# Altium schematic sheet V-by-One.SchDoc
size 420 x 297 mm; SheetNumber: 21; SheetTotal: 32; DocumentTypeShort: Э3; DocumentInvertoryNumber: ㅤ
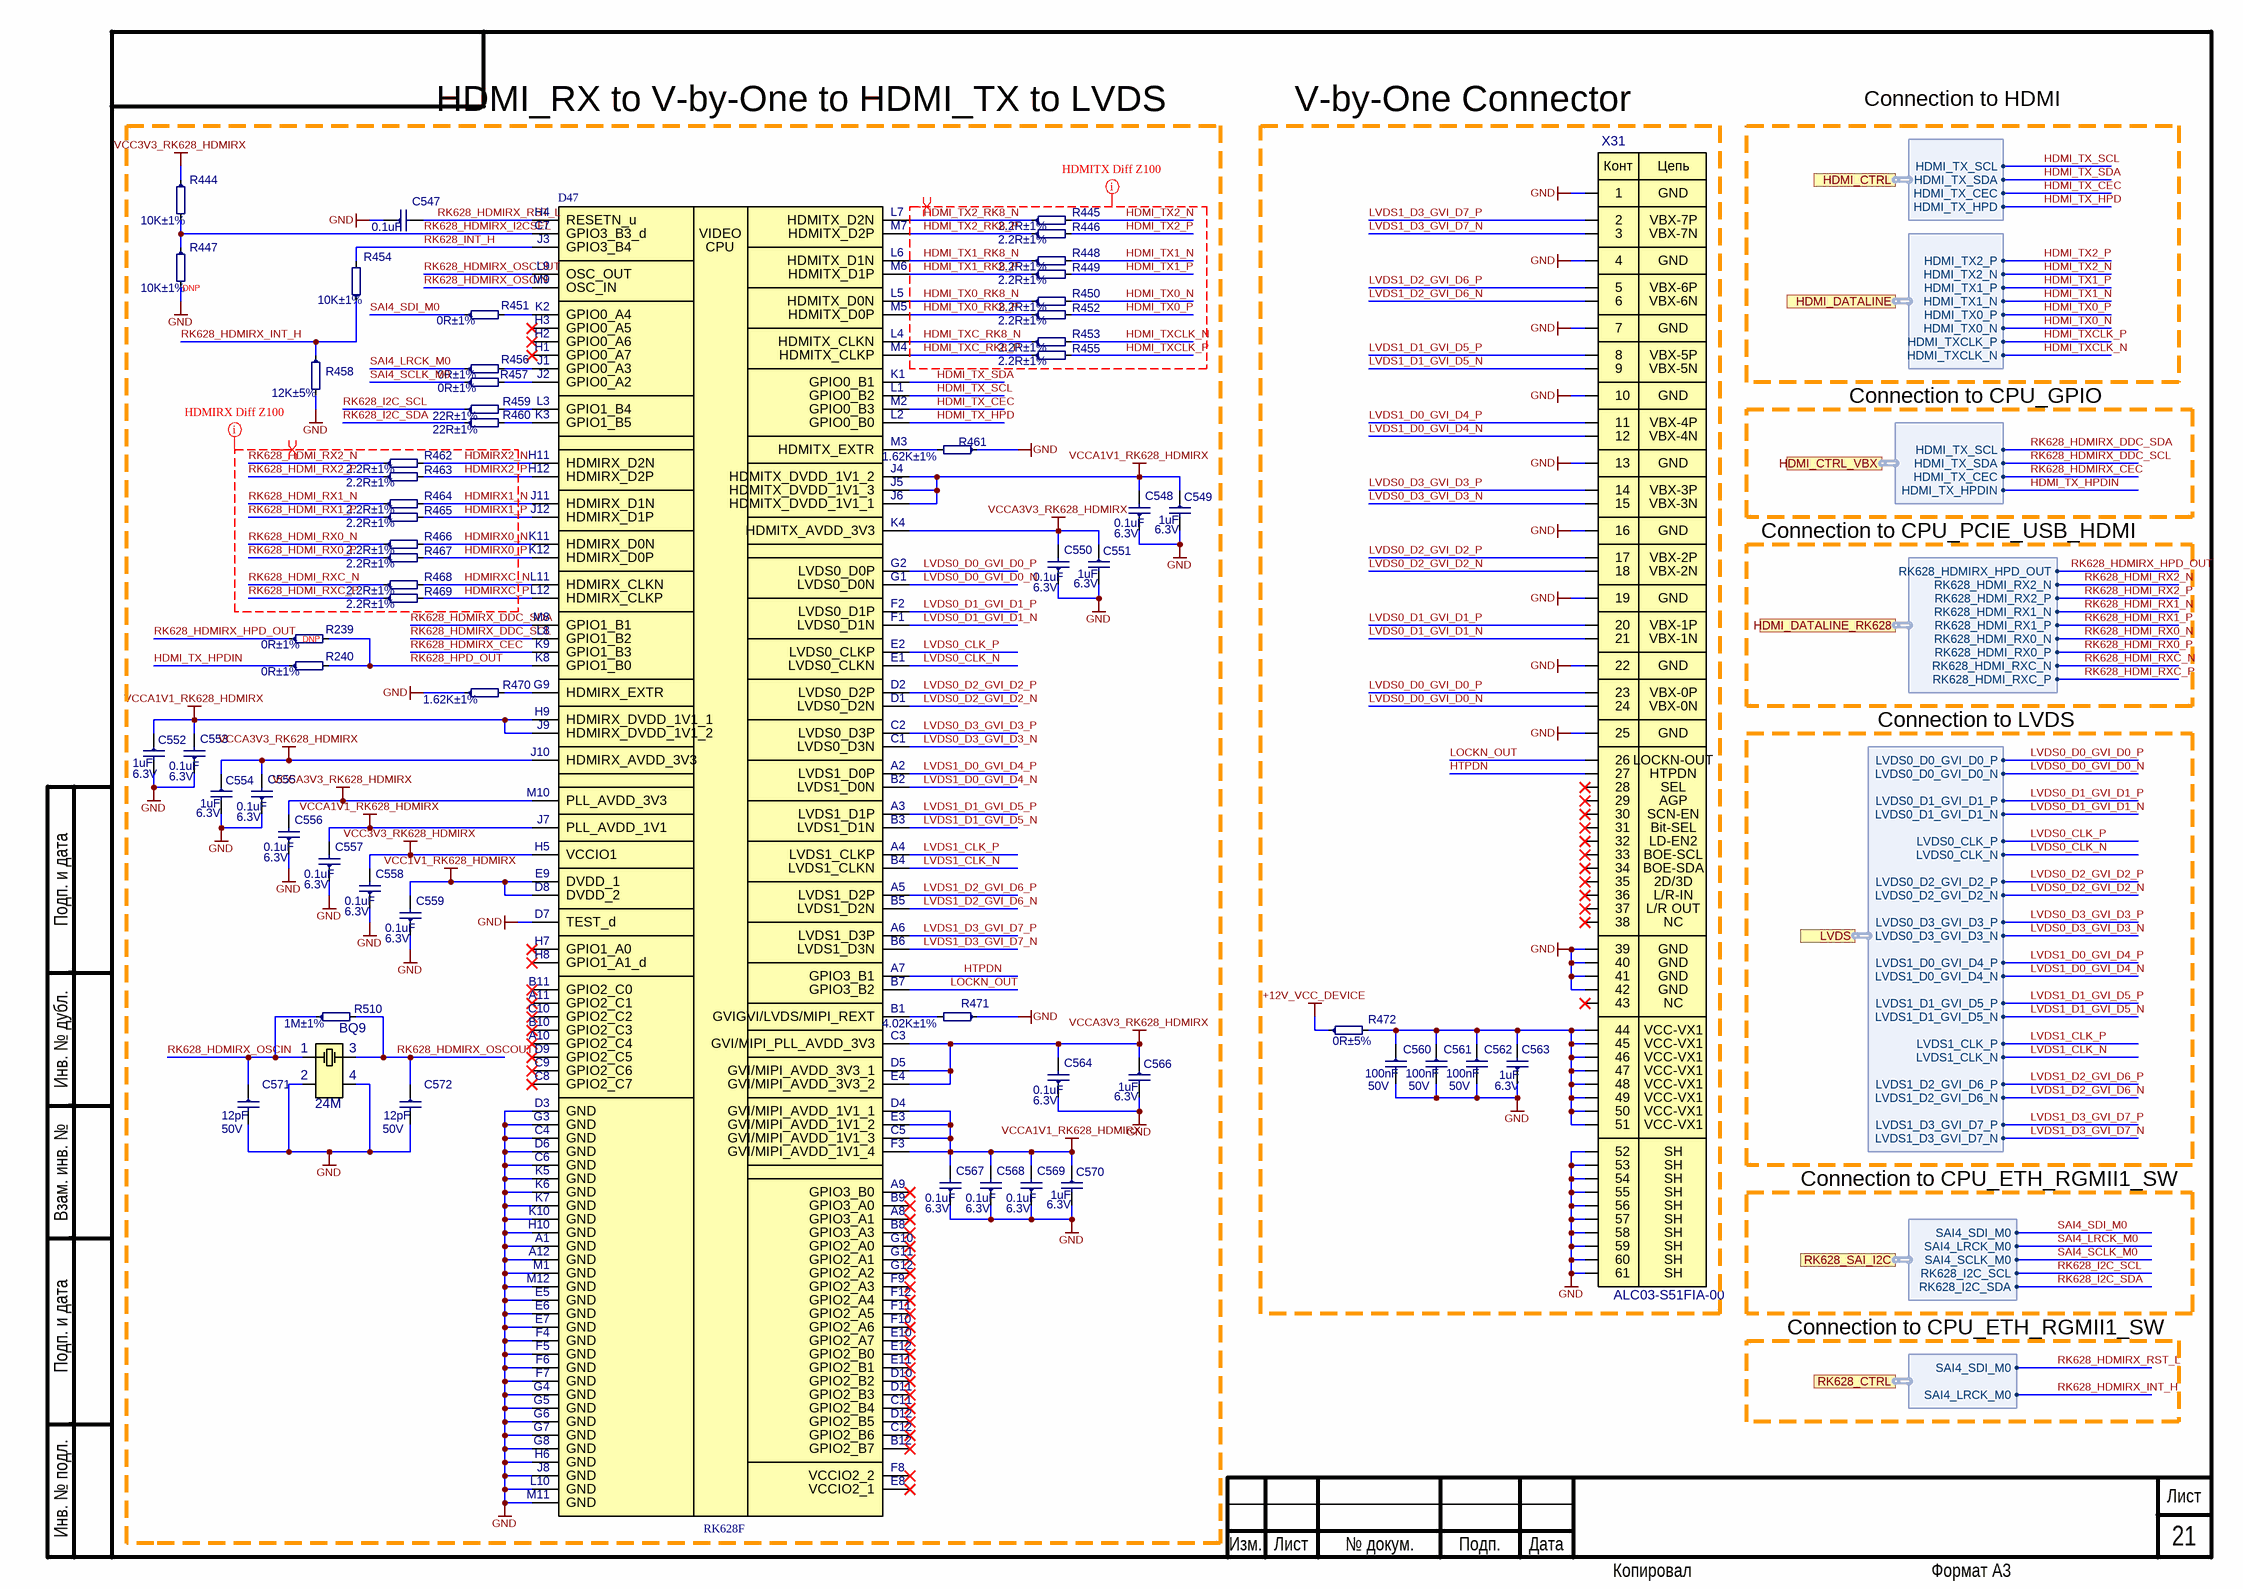
[diagram p0: V-by-One.SchDoc]

## Parts
BQ9  24M  [NX3225GA]
C547  0.1uF  [C0201]
C548  0.1uF  Voltage: 6.3V  [C0201]
C549  1uF  Voltage: 6.3V  [C0201]
C550  0.1uF  Voltage: 6.3V  [C0201]
C551  1uF  Voltage: 6.3V  [C0201]
C552  1uF  Voltage: 6.3V  [C0201]
C553  0.1uF  Voltage: 6.3V  [C0201]
C554  1uF  Voltage: 6.3V  [C0201]
C555  0.1uF  Voltage: 6.3V  [C0201]
C556  0.1uF  Voltage: 6.3V  [C0201]
C557  0.1uF  Voltage: 6.3V  [C0201]
C558  0.1uF  Voltage: 6.3V  [C0201]
C559  0.1uF  Voltage: 6.3V  [C0201]
C560  100nF  Voltage: 50V  [C0402]
C561  100nF  Voltage: 50V  [C0402]
C562  100nF  Voltage: 50V  [C0402]
C563  1uF  Voltage: 6.3V  [C0201]
C564  0.1uF  Voltage: 6.3V  [C0201]
C566  1uF  Voltage: 6.3V  [C0201]
C567  0.1uF  Voltage: 6.3V  [C0201]
C568  0.1uF  Voltage: 6.3V  [C0201]
C569  0.1uF  Voltage: 6.3V  [C0201]
C570  1uF  Voltage: 6.3V  [C0201]
C571  12pF  Voltage: 50V  [C0402]
C572  12pF  Voltage: 50V  [C0402]
D47  RK628F  [RK628F]
R239  0R±1%  [R0402]
R240  0R±1%  [R0402]
R444  10K±1%  [R0402]
R445  2.2R±1%  [R0402]
R446  2.2R±1%  [R0402]
R447  10K±1%  [R0402]
R448  2.2R±1%  [R0402]
R449  2.2R±1%  [R0402]
R450  2.2R±1%  [R0402]
R451  0R±1%  [R0402]
R452  2.2R±1%  [R0402]
R453  2.2R±1%  [R0402]
R454  10K±1%  [R0402]
R455  2.2R±1%  [R0402]
R456  0R±1%  [R0402]
R457  0R±1%  [R0402]
R458  12K±5%  [R0402]
R459  22R±1%  [R0402]
R460  22R±1%  [R0402]
R461  1.62K±1%  [R0402]
R462  2.2R±1%  [R0402]
R463  2.2R±1%  [R0402]
R464  2.2R±1%  [R0402]
R465  2.2R±1%  [R0402]
R466  2.2R±1%  [R0402]
R467  2.2R±1%  [R0402]
R468  2.2R±1%  [R0402]
R469  2.2R±1%  [R0402]
R470  1.62K±1%  [R0402]
R471  4.02K±1%  [R0402]
R472  0R±5%  [R2010]
R510  1M±1%  [R0402]
X31  ALC03-S51FIA-00  [ALC03-S51FIA-00]

## Ports
HDMI_CTRL (harness HDMI_CTRL), HDMI_CTRL_VBX (harness HDMI_CTRL_VBX), HDMI_DATALINE (harness HDMI_DATALINE), HDMI_DATALINE_RK628 (harness HDMI_DATALINE_RK628), LVDS (harness LVDS), RK628_CTRL (harness RK628_CTRL), RK628_SAI_I2C (harness RK628_SAI_I2C)

## Harnesses
HDMI_CTRL: HDMI_TX_SDA, HDMI_TX_CEC, HDMI_TX_HPD, HDMI_TX_SCL
HDMI_DATALINE: HDMI_TX2_N, HDMI_TX1_P, HDMI_TX1_N, HDMI_TX2_P, HDMI_TX0_P, HDMI_TX0_N, HDMI_TXCLK_P, HDMI_TXCLK_N
HDMI_CTRL_VBX: HDMI_TX_SDA, HDMI_TX_CEC, HDMI_TX_SCL, HDMI_TX_HPDIN
LVDS: LVDS0_D0_GVI_D0_N, LVDS0_D1_GVI_D1_P, LVDS0_D1_GVI_D1_N, LVDS0_D0_GVI_D0_P, LVDS0_CLK_P, LVDS0_CLK_N, LVDS0_D2_GVI_D2_P, LVDS0_D2_GVI_D2_N, LVDS0_D3_GVI_D3_P, LVDS0_D3_GVI_D3_N, LVDS1_D0_GVI_D4_P, LVDS1_D0_GVI_D4_N, LVDS1_D1_GVI_D5_P, LVDS1_D1_GVI_D5_N, LVDS1_CLK_P, LVDS1_CLK_N, LVDS1_D2_GVI_D6_P, LVDS1_D2_GVI_D6_N, LVDS1_D3_GVI_D7_P, LVDS1_D3_GVI_D7_N
HDMI_DATALINE_RK628: RK628_HDMI_RX2_P, RK628_HDMI_RX1_N, RK628_HDMI_RX1_P, RK628_HDMI_RX2_N, RK628_HDMI_RX0_N, RK628_HDMI_RX0_P, RK628_HDMI_RXC_N, RK628_HDMI_RXC_P, RK628_HDMIRX_HPD_OUT
RK628_SAI_I2C: SAI4_LRCK_M0, SAI4_SCLK_M0, SAI4_SDI_M0, RK628_I2C_SCL, RK628_I2C_SDA
RK628_CTRL: SAI4_LRCK_M0, SAI4_SDI_M0

## Nets
+12V_VCC_DEVICE: R472.1
GND: BQ9.2 BQ9.4 C547.1 C548.1 C549.2 C550.1 C551.2 C552.2 C553.1 C554.2 C555.1 C556.1 C557.1 C558.1 C559.1 C560.2 C561.2 C562.2 C563.1 C564.1 C566.2 C567.1 C568.1 C569.1 C570.2 C571.2 C572.2 D47.A1(GND) D47.A12(GND) D47.C4(GND) D47.C6(GND) D47.D3(GND) D47.D6(GND) D47.D7(TEST_d) D47.E5(GND) D47.E6(GND) D47.E7(GND) D47.F4(GND) D47.F5(GND) D47.F6(GND) D47.F7(GND) D47.G3(GND) D47.G4(GND) D47.G5(GND) D47.G6(GND) D47.G7(GND) D47.G8(GND) D47.H6(GND) D47.H10(GND) D47.J8(GND) D47.K5(GND) D47.K6(GND) D47.K7(GND) D47.K10(GND) D47.L10(GND) D47.M1(GND) D47.M11(GND) D47.M12(GND) R447.2 R458.2 R461.1 R470.1 R471.1 X31.1 X31.4 X31.7 X31.10 X31.13 X31.16 X31.19 X31.22 X31.25 X31.39 X31.40 X31.41 X31.42 X31.52 X31.53 X31.54 X31.55 X31.56 X31.57 X31.58 X31.59 X31.60 X31.61
VCC1V1_RK628_HDMIRX: C559.2 D47.D8(DVDD_2) D47.E9(DVDD_1)
VCC3V3_RK628_HDMIRX: C558.2 D47.H5(VCCIO1) R444.1
VCCA1V1_RK628_HDMIRX: C548.2 C549.1 C552.1 C553.2 C557.2 C567.2 C568.2 C569.2 C570.1 D47.C5(GVI/MIPI_AVDD_1V1_3) D47.D4(GVI/MIPI_AVDD_1V1_1) D47.E3(GVI/MIPI_AVDD_1V1_2) D47.F3(GVI/MIPI_AVDD_1V1_4) D47.H9(HDMIRX_DVDD_1V1_1) D47.J4(HDMITX_DVDD_1V1_2) D47.J5(HDMITX_DVDD_1V1_3) D47.J6(HDMITX_DVDD_1V1_1) D47.J7(PLL_AVDD_1V1) D47.J9(HDMIRX_DVDD_1V1_2)
VCCA3V3_RK628_HDMIRX: C550.2 C551.1 C554.1 C555.2 C556.2 C564.2 C566.1 D47.C3(GVI/MIPI_PLL_AVDD_3V3) D47.D5(GVI/MIPI_AVDD_3V3_1) D47.E4(GVI/MIPI_AVDD_3V3_2) D47.J10(HDMIRX_AVDD_3V3) D47.K4(HDMITX_AVDD_3V3) D47.M10(PLL_AVDD_3V3)
HDMI_TX0_N: R450.2 ; port HDMI_DATALINE.HDMI_TX0_N
HDMI_TX0_P: R452.2 ; port HDMI_DATALINE.HDMI_TX0_P
HDMI_TX0_RK8_N: D47.L5(HDMITX_D0N) R450.1
HDMI_TX0_RK8_P: D47.M5(HDMITX_D0P) R452.1
HDMI_TX1_N: R448.2 ; port HDMI_DATALINE.HDMI_TX1_N
HDMI_TX1_P: R449.2 ; port HDMI_DATALINE.HDMI_TX1_P
HDMI_TX1_RK8_N: D47.L6(HDMITX_D1N) R448.1
HDMI_TX1_RK8_P: D47.M6(HDMITX_D1P) R449.1
HDMI_TX2_N: R445.2 ; port HDMI_DATALINE.HDMI_TX2_N
HDMI_TX2_P: R446.2 ; port HDMI_DATALINE.HDMI_TX2_P
HDMI_TX2_RK8_N: D47.L7(HDMITX_D2N) R445.1
HDMI_TX2_RK8_P: D47.M7(HDMITX_D2P) R446.1
HDMI_TX_CEC: D47.M2(GPIO0_B3) ; port HDMI_CTRL.HDMI_TX_CEC
HDMI_TX_HPD: D47.L2(GPIO0_B0) ; port HDMI_CTRL.HDMI_TX_HPD
HDMI_TX_HPDIN: R240.1 ; port HDMI_CTRL_VBX.HDMI_TX_HPDIN
HDMI_TX_SCL: D47.L1(GPIO0_B2) ; port HDMI_CTRL.HDMI_TX_SCL
HDMI_TX_SDA: D47.K1(GPIO0_B1) ; port HDMI_CTRL.HDMI_TX_SDA
HDMI_TXC_RK8_N: D47.L4(HDMITX_CLKN) R453.1
HDMI_TXC_RK8_P: D47.M4(HDMITX_CLKP) R455.1
HDMI_TXCLK_N: R453.2 ; port HDMI_DATALINE.HDMI_TXCLK_N
HDMI_TXCLK_P: R455.2 ; port HDMI_DATALINE.HDMI_TXCLK_P
HDMIRX0_N: D47.K11(HDMIRX_D0N) R466.2
HDMIRX0_P: D47.K12(HDMIRX_D0P) R467.2
HDMIRX1_N: D47.J11(HDMIRX_D1N) R464.2
HDMIRX1_P: D47.J12(HDMIRX_D1P) R465.2
HDMIRX2_N: D47.H11(HDMIRX_D2N) R462.2
HDMIRX2_P: D47.H12(HDMIRX_D2P) R463.2
HDMIRXC_N: D47.L11(HDMIRX_CLKN) R468.2
HDMIRXC_P: D47.L12(HDMIRX_CLKP) R469.2
HTPDN: D47.A7(GPIO3_B1) X31.27
LOCKN_OUT: D47.B7(GPIO3_B2) X31.26
LVDS0_CLK_N: D47.E1(LVDS0_CLKN) ; port LVDS.LVDS0_CLK_N
LVDS0_CLK_P: D47.E2(LVDS0_CLKP) ; port LVDS.LVDS0_CLK_P
LVDS0_D0_GVI_D0_N: D47.G1(LVDS0_D0N) X31.24 ; port LVDS.LVDS0_D0_GVI_D0_N
LVDS0_D0_GVI_D0_P: D47.G2(LVDS0_D0P) X31.23 ; port LVDS.LVDS0_D0_GVI_D0_P
LVDS0_D1_GVI_D1_N: D47.F1(LVDS0_D1N) X31.21 ; port LVDS.LVDS0_D1_GVI_D1_N
LVDS0_D1_GVI_D1_P: D47.F2(LVDS0_D1P) X31.20 ; port LVDS.LVDS0_D1_GVI_D1_P
LVDS0_D2_GVI_D2_N: D47.D1(LVDS0_D2N) X31.18 ; port LVDS.LVDS0_D2_GVI_D2_N
LVDS0_D2_GVI_D2_P: D47.D2(LVDS0_D2P) X31.17 ; port LVDS.LVDS0_D2_GVI_D2_P
LVDS0_D3_GVI_D3_N: D47.C1(LVDS0_D3N) X31.15 ; port LVDS.LVDS0_D3_GVI_D3_N
LVDS0_D3_GVI_D3_P: D47.C2(LVDS0_D3P) X31.14 ; port LVDS.LVDS0_D3_GVI_D3_P
LVDS1_CLK_N: D47.B4(LVDS1_CLKN) ; port LVDS.LVDS1_CLK_N
LVDS1_CLK_P: D47.A4(LVDS1_CLKP) ; port LVDS.LVDS1_CLK_P
LVDS1_D0_GVI_D4_N: D47.B2(LVDS1_D0N) X31.12 ; port LVDS.LVDS1_D0_GVI_D4_N
LVDS1_D0_GVI_D4_P: D47.A2(LVDS1_D0P) X31.11 ; port LVDS.LVDS1_D0_GVI_D4_P
LVDS1_D1_GVI_D5_N: D47.B3(LVDS1_D1N) X31.9 ; port LVDS.LVDS1_D1_GVI_D5_N
LVDS1_D1_GVI_D5_P: D47.A3(LVDS1_D1P) X31.8 ; port LVDS.LVDS1_D1_GVI_D5_P
LVDS1_D2_GVI_D6_N: D47.B5(LVDS1_D2N) X31.6 ; port LVDS.LVDS1_D2_GVI_D6_N
LVDS1_D2_GVI_D6_P: D47.A5(LVDS1_D2P) X31.5 ; port LVDS.LVDS1_D2_GVI_D6_P
LVDS1_D3_GVI_D7_N: D47.B6(LVDS1_D3N) X31.3 ; port LVDS.LVDS1_D3_GVI_D7_N
LVDS1_D3_GVI_D7_P: D47.A6(LVDS1_D3P) X31.2 ; port LVDS.LVDS1_D3_GVI_D7_P
RK628_HDMI_RX0_N: R466.1 ; port HDMI_DATALINE_RK628.RK628_HDMI_RX0_N
RK628_HDMI_RX0_P: R467.1 ; port HDMI_DATALINE_RK628.RK628_HDMI_RX0_P
RK628_HDMI_RX1_N: R464.1 ; port HDMI_DATALINE_RK628.RK628_HDMI_RX1_N
RK628_HDMI_RX1_P: R465.1 ; port HDMI_DATALINE_RK628.RK628_HDMI_RX1_P
RK628_HDMI_RX2_N: R462.1 ; port HDMI_DATALINE_RK628.RK628_HDMI_RX2_N
RK628_HDMI_RX2_P: R463.1 ; port HDMI_DATALINE_RK628.RK628_HDMI_RX2_P
RK628_HDMI_RXC_N: R468.1 ; port HDMI_DATALINE_RK628.RK628_HDMI_RXC_N
RK628_HDMI_RXC_P: R469.1 ; port HDMI_DATALINE_RK628.RK628_HDMI_RXC_P
RK628_HDMIRX_CEC: D47.K9(GPIO1_B3) ; port HDMI_CTRL_VBX.HDMI_TX_CEC
RK628_HDMIRX_DDC_SCL: D47.L8(GPIO1_B2) ; port HDMI_CTRL_VBX.HDMI_TX_SDA
RK628_HDMIRX_DDC_SDA: D47.M8(GPIO1_B1) ; port HDMI_CTRL_VBX.HDMI_TX_SCL
RK628_HDMIRX_HPD_OUT: R239.1 ; port HDMI_DATALINE_RK628.RK628_HDMIRX_HPD_OUT
RK628_HDMIRX_I2CSEL: D47.C7(GPIO3_B3_d) R444.2 R447.1
RK628_HDMIRX_INT_H: R454.1 R458.1 ; port RK628_CTRL.SAI4_LRCK_M0
RK628_HDMIRX_OSCIN: BQ9.1 C571.1 D47.M9(OSC_IN) R510.1
RK628_HDMIRX_OSCOUT: BQ9.3 C572.1 D47.L9(OSC_OUT) R510.2
RK628_HDMIRX_RST_L: C547.2 D47.H4(RESETN_u) ; port RK628_CTRL.SAI4_SDI_M0
RK628_HPD_OUT: D47.K8(GPIO1_B0) R239.2 R240.2
RK628_I2C_SCL: R459.1 ; port RK628_SAI_I2C.RK628_I2C_SCL
RK628_I2C_SDA: R460.1 ; port RK628_SAI_I2C.RK628_I2C_SDA
RK628_INT_H: D47.J3(GPIO3_B4) R454.2
SAI4_LRCK_M0: R456.1 ; port RK628_SAI_I2C.SAI4_LRCK_M0
SAI4_SCLK_M0: R457.1 ; port RK628_SAI_I2C.SAI4_SCLK_M0
SAI4_SDI_M0: R451.1 ; port RK628_SAI_I2C.SAI4_SDI_M0
NetC560_1: C560.1 C561.1 C562.1 C563.2 R472.2 X31.44 X31.45 X31.46 X31.47 X31.48 X31.49 X31.50 X31.51
NetD47_B1: D47.B1(GVIGVI/LVDS/MIPI_REXT) R471.2
NetD47_G9: D47.G9(HDMIRX_EXTR) R470.2
NetD47_J1: D47.J1(GPIO0_A3) R456.2
NetD47_J2: D47.J2(GPIO0_A2) R457.2
NetD47_K2: D47.K2(GPIO0_A4) R451.2
NetD47_K3: D47.K3(GPIO1_B5) R460.2
NetD47_L3: D47.L3(GPIO1_B4) R459.2
NetD47_M3: D47.M3(HDMITX_EXTR) R461.2

Not connected (* = marked no-connect by the designer): D47 A8(GPIO3_A1)* A9(GPIO3_B0)* A10(GPIO2_C4)* A11(GPIO2_C1)* B8(GPIO3_A3)* B9(GPIO3_A0)* B10(GPIO2_C3)* B11(GPIO2_C0)* B12(GPIO2_B7)* C8(GPIO2_C7)* C9(GPIO2_C6)* C10(GPIO2_C2)* C11(GPIO2_B4)* C12(GPIO2_B6)* D9(GPIO2_C5)* D10(GPIO2_B2)* D11(GPIO2_B3)* D12(GPIO2_B5)* E8(VCCIO2_1)* E10(GPIO2_A7)* E11(GPIO2_B1)* E12(GPIO2_B0)* F8(VCCIO2_2)* F9(GPIO2_A3)* F10(GPIO2_A6)* F11(GPIO2_A5)* F12(GPIO2_A4)* G10(GPIO2_A0)* G11(GPIO2_A1)* G12(GPIO2_A2)* H1(GPIO0_A7)* H2(GPIO0_A6)* H3(GPIO0_A5)* H7(GPIO1_A0)* H8(GPIO1_A1_d)*; X31 28* 29* 30* 31* 32* 33* 34* 35* 36* 37* 38* 43*

## Layout directives
net class HDMIRX: HDMIRX0_N, HDMIRX0_P, HDMIRX1_N, HDMIRX1_P, HDMIRX2_N, HDMIRX2_P, HDMIRXC_N, HDMIRXC_P, RK628_HDMI_RX0_N, RK628_HDMI_RX0_P, RK628_HDMI_RX1_N, RK628_HDMI_RX1_P, RK628_HDMI_RX2_N, RK628_HDMI_RX2_P, RK628_HDMI_RXC_N, RK628_HDMI_RXC_P
net class HDMITX: HDMI_TX0_N, HDMI_TX0_P, HDMI_TX0_RK8_N, HDMI_TX0_RK8_P, HDMI_TX1_N, HDMI_TX1_P, HDMI_TX1_RK8_N, HDMI_TX1_RK8_P, HDMI_TX2_N, HDMI_TX2_P, HDMI_TX2_RK8_N, HDMI_TX2_RK8_P, HDMI_TXC_RK8_N, HDMI_TXC_RK8_P, HDMI_TXCLK_N, HDMI_TXCLK_P
differential pair; differential pair class Diff_Z100: HDMI_TX0_N, HDMI_TX0_P, HDMI_TX0_RK8_N, HDMI_TX0_RK8_P, HDMI_TX1_N, HDMI_TX1_P, HDMI_TX1_RK8_N, HDMI_TX1_RK8_P, HDMI_TX2_N, HDMI_TX2_P, HDMI_TX2_RK8_N, HDMI_TX2_RK8_P, HDMI_TXC_RK8_N, HDMI_TXC_RK8_P, HDMI_TXCLK_N, HDMI_TXCLK_P, HDMIRX0_N, HDMIRX0_P, HDMIRX1_N, HDMIRX1_P, HDMIRX2_N, HDMIRX2_P, HDMIRXC_N, HDMIRXC_P, RK628_HDMI_RX0_N, RK628_HDMI_RX0_P, RK628_HDMI_RX1_N, RK628_HDMI_RX1_P, RK628_HDMI_RX2_N, RK628_HDMI_RX2_P, RK628_HDMI_RXC_N, RK628_HDMI_RXC_P

## Notes on the sheet
- HDMI_RX to V-by-One to HDMI_TX to LVDS
- V-by-One Connector
- Connection to HDMI
- (near R447) DNP
- Connection to CPU_GPIO
- Connection to CPU_PCIE_USB_HDMI
- (near R239) DNP
- Connection to LVDS
- Connection to CPU_ETH_RGMII1_SW
- Подп. и дата
- Инв. № дубл.
- Взам. инв. №
- Инв. № подл.
- Изм.
- Лист
- № докум.
- Подп.
- Дата
- Копировал
- Формат А3
- (in symbol ALC03-S51FIA-00) Конт; Цепь; GND; VBX-7P; VBX-7N; VBX-6P; VBX-6N; VBX-5P; VBX-5N; VBX-4P; VBX-4N; VBX-3P; VBX-3N; VBX-2P; VBX-2N; VBX-1P; VBX-1N; VBX-0P; VBX-0N; LOCKN-OUT; HTPDN; SEL; AGP; SCN-EN; Bit-SEL; LD-EN2; BOE-SCL; BOE-SDA; 2D/3D; L/R-IN; L/R OUT; NC; VCC-VX1; SH
- (in symbol RK628F) VIDEO; CPU

## Library data of the parts
BQ9 = NX3225GA-24M-18pF-10ppm: Part Number: 3225-24-18-10-10/4B; Manufacturer: Liming; Place: S; Tolerance: 10ppm; Check: False; Value: 24M; NameFromManufacturer: 3225-24-18-10-10/4B; ComponentLink1Description: DATASHEET; ComponentLink1URL: https://www.raltron.com/wp-content/uploads/2019/07/RH100_SERIES-July-2019.pdf; Last changed: 27.10.2022
C547 = 0201-X5R-6.3V-0.1uF±10%: Manufacturer: Yageo; NameFromManufacturer: CC0201KRX5R5BB104; Dielectric: X5R; Voltage: 6.3V; Place: *); Tolerance: 10%; Check: False; Case: C0201; Part Number: 0201-X5R-6.3V-0.1uF±10%; Value: 0.1uF; Temperature: -55°C~85°C; ComponentLink2Description: Link to datasheet; ComponentLink1Description: DATASHEET; ComponentLink2URL: https://www.terraelectronica.ru/product/1020032; ComponentLink1URL: Datasheets/capacitors/UPY-GPHC_X5R_4V-to-50V_27.pdf; Last changed: 27.10.2022
C548 C550 C553 C555-C559 C564 C567-C569 = 0201-X5R-6.3V-0.1uF±10%: Manufacturer: Yageo; NameFromManufacturer: CC0201KRX5R5BB104; Dielectric: X5R; Place: *); Tolerance: 10%; Check: False; Case: C0201; Part Number: 0201-X5R-6.3V-0.1uF±10%; Value: 0.1uF; Temperature: -55°C~85°C; ComponentLink2Description: Link to datasheet; ComponentLink1Description: DATASHEET; ComponentLink2URL: https://www.terraelectronica.ru/product/1020032; ComponentLink1URL: Datasheets/capacitors/UPY-GPHC_X5R_4V-to-50V_27.pdf; Last changed: 27.10.2022
C549 C551 C552 C554 C563 C566 C570 = 0201-X5R-6.3V-1uF±20%: Manufacturer: Murata Electronics; NameFromManufacturer: GRM033R60J105MEA2D; Dielectric: X5R; Place: *); Tolerance: 20%; Check: False; Case: C0201; Part Number: 0201-X5R-6.3V-1uF±20%; Value: 1uF; Temperature: -55°C~85°C; ComponentLink2Description: Link to datasheet; ComponentLink1Description: DATASHEET; ComponentLink2URL: https://www.terraelectronica.ru/product/1209278; ComponentLink1URL: Datasheets/capacitors/GRM033R60J105MEA2-61A.pdf; Last changed: 27.10.2022
C560-C562 = 0402-X7R-50V-0.1uF±10%: Ceramic Capacitor 0402 100nF ±10% 50V X7R; Manufacturer: Yageo; NameFromManufacturer: CC0402KRX7R9BB104; Place: *); Check: False; Dielectric: X7R; Case: C0402; Part Number: 0402-X7R-50V-0.1uF±10%; Value: 100nF; Tolerance: 10%; Temperature: -55°C~125°C; ComponentLink2Description: Link to datasheet; ComponentLink1Description: DATASHEET; ComponentLink2URL: https://www.lcsc.com/product-detail/Multilayer-Ceramic-Capacitors-MLCC-SMD-SMT_YAGEO-CC0402KRX7R9BB104_C131394.html; Last changed: 09.04.2025
C571 C572 = 0402-NP0-50V-12pF±5%: Manufacturer: Murata Electronics; NameFromManufacturer: GRM1555C1H120JA01D; Dielectric: NP0; Place: *); Tolerance: 5%; Check: False; Case: C0402; Part Number: 0402-NP0-50V-12pF±5%; Value: 12pF; Temperature: -55°C~125°C; ComponentLink2Description: Link to datasheet; ComponentLink1Description: DATASHEET; ComponentLink2URL: https://www.terraelectronica.ru/pdf/show?pdf_file=http%253A%252F%252Fwww.farnell.com%252Fdatasheets%252F2048662.pdf; ComponentLink1URL: Datasheets/capacitors/GRM1555C1H120JA01-01A.pdf; Last changed: 27.10.2022
D47 = RK628F: Bridge BGA-144L(8x8) Video Processing RoHS; Manufacturer: Rockchip; Check: False; Part Number: RK628F; Value: RK628F; NameFromManufacturer: RK628F
R239 R240 R451 R456 R457 = 0402-0.0625W-0R-100ppm±1%: Chip Resistor 0402 0Ω ±1% 50V ±100ppm/℃ Thick Film; NameFromManufacturer: RC0402FR-070RL; Manufacturer: Yageo; Place: *); Value: 0R; Check: False; Case: R0402; Part Number: 0402-0.0625W-0R-100ppm±1%; Tolerance: 1%; Temperature: -55°C~155°C; ComponentLink1Description: DATASHEET; ComponentLink1URL: https://www.chipdip.ru/product0/8000617426?ysclid=l7og5x0plo427794326; Datasheet: Datasheets/resistors/DOC012445956.pdf; Last changed: 27.10.2022
R444 R447 R454 = 0402-0.0625W-10K-100ppm±1%: Chip Resistor 0402 10kΩ ±1% 50V ±100ppm/℃ Thick Film; NameFromManufacturer: RC0402FR-0710KL; Manufacturer: Yageo; Place: *); Value: 10K; Check: False; Case: R0402; Part Number: 0402-0.0625W-10K-100ppm±1%; Tolerance: 1%; Temperature: -55°C~155°C; ComponentLink1Description: DATASHEET; ComponentLink1URL: https://ru.mouser.com/ProductDetail/YAGEO/RC0402FR-0710KL?qs=%2Fha2pyFaduhjtLcYvKXQ8IogF7YwN7YtH%252BOO8ZtEEMnoa4yoWYcwpw%3D%3D; Datasheet: Datasheets/resistors/PYu-RC_Group_51_RoHS_L_11.pdf; Last changed: 27.10.2022
R445 R446 R448-R450 R452 R453 R455 R462-R469 = 0402-0.0625W-1.2R-100ppm±1%: Part Number: 0402-0.0625W-2.2R-100ppm±1%; NameFromManufacturer: AC0402FR-072R2L; Manufacturer: Yageo; Place: *); Value: 2.2R; Tolerance: 1%; Check: False; Case: R0402; Temperature: -55°C~155°C; ComponentLink1Description: DATASHEET; ComponentLink1URL: https://www.chipdip.ru/product0/9000189669; Datasheet: Datasheets/resistors/DOC011312614.pdf; Last changed: 27.10.2022
R458 = 0402-0.0625W-12K-100ppm±5%: NameFromManufacturer: WR04X123JTL; Manufacturer: Walsin Technology Corporation; Place: *); Value: 12K; Tolerance: 5%; Check: False; Case: R0402; Part Number: 0402-0.0625W-12K-100ppm±5%; Temperature: -55°C~155°C; ComponentLink1Description: DATASHEET; ComponentLink1URL: https://eu.mouser.com/ProductDetail/Walsin/WR04X123-JTL?qs=1w%252B2sDiFrrEqkjp89ZDzsQ%3D%3D; Datasheet: Datasheets\resistors\WR04X103JTL-datasheet-pdf-ru.findic.com.pdf#Datasheets\resistors\WR04X103JTL-datasheet-pdf-ru.findic.com.pdf#; Last changed: 07.11.2022
R459 R460 = 0402-0.0625W-22R-100ppm±1%: Chip Resistor 0402 22Ω ±1% 50V ±100ppm/℃ Thick Film; NameFromManufacturer: RC0402FR-0722RL; Manufacturer: Yageo; Place: *); Value: 22R; Check: False; Case: R0402; Part Number: 0402-0.0625W-22R-100ppm±1%; Tolerance: 1%; Temperature: -55°C~155°C; ComponentLink1Description: DATASHEET; ComponentLink1URL: https://www.yageo.com/upload/media/product/productsearch/datasheet/rchip/PYu-RC_Group_51_RoHS_L_11.pdf; Datasheet: Datasheets/resistors/PYu-RC_Group_51_RoHS_L_11.pdf; Last changed: 27.10.2022
R461 R470 = 0402-0.0625W-1.62K-100ppm±1%: NameFromManufacturer: RC0402FR-071K62L; Manufacturer: Yageo; Place: *); Value: 1.62K; Tolerance: 1%; Check: False; Case: R0402; Part Number: 0402-0.0625W-1.62K-100ppm±1%; Temperature: -55°C~155°C; ComponentLink1Description: DATASHEET; ComponentLink1URL: https://www.digikey.com/en/products/detail/yageo/RC0402FR-071K62L/5280902; Datasheet: Datasheets/resistors/PYu-RC_Group_51_RoHS_L_11.pdf; Last changed: 27.10.2022
R471 = 0402-0.0625W-1.62K-100ppm±1%: Part Number: 0402-0.0625W-4.02K-100ppm±1%; NameFromManufacturer: RC0402FR-074K02L; Manufacturer: Yageo; Place: *); Value: 4.02K; Tolerance: 1%; Check: False; Case: R0402; Temperature: -55°C~155°C; ComponentLink1Description: DATASHEET; ComponentLink1URL: https://www.digikey.com/en/products/detail/yageo/RC0402FR-071K62L/5280902; Datasheet: Datasheets/resistors/PYu-RC_Group_51_RoHS_L_11.pdf; Last changed: 27.10.2022
R472 = 2010-0.75W-0R-200ppm±5%: Chip Resistor 2010 0Ω ±5% 200V ±200ppm/℃ Thick Film; NameFromManufacturer: RC2010JK-070RL; Manufacturer: Yageo; Place: *); Value: 0R; Check: False; Case: R2010; Part Number: 2010-0.75W-0R-200ppm±5%; Tolerance: 5%; Temperature: -55°C~155°C; ComponentLink1Description: DATASHEET; ComponentLink1URL: https://www.lcsc.com/product-detail/Chip-Resistor-Surface-Mount_YAGEO-RC2010JK-070RL_C152156.html; Last changed: 16.07.2024
R510 = 0402-0.0625W-1M-100ppm±1%: Chip Resistor 0402 1MΩ ±1% 50V ±100ppm/℃ Thick Film; NameFromManufacturer: RC0402FR-071ML; Manufacturer: Yageo; Place: *); Value: 1M; Check: False; Case: R0402; Part Number: 0402-0.0625W-1M-100ppm±1%; Tolerance: 1%; Temperature: -55°C~155°C; ComponentLink1Description: DATASHEET; ComponentLink1URL: https://www.yageo.com/upload/media/product/productsearch/datasheet/rchip/PYu-RC_Group_51_RoHS_L_11.pdf; Datasheet: Datasheets/resistors/PYu-RC_Group_51_RoHS_L_11.pdf; Last changed: 27.10.2022
X31 = ALC03-S51FIA-00: Non-Latching 51P 0.5mm 500mA 50V Bottom Contact Surface Mount, Right Angle SMD,P=0.5mm,Surface Mount,Right Angle FFC, FPC (Flat Flexible) Connector Assemblies RoHS; Manufacturer: JUSHUO; Check: False; Part Number: ALC03-S51FIA-00; Value: ALC03-S51FIA-00; NameFromManufacturer: ALC03-S51FIA-00